# Altium project GL3227E_GL-Flash_Ver0.1.PrjPcb
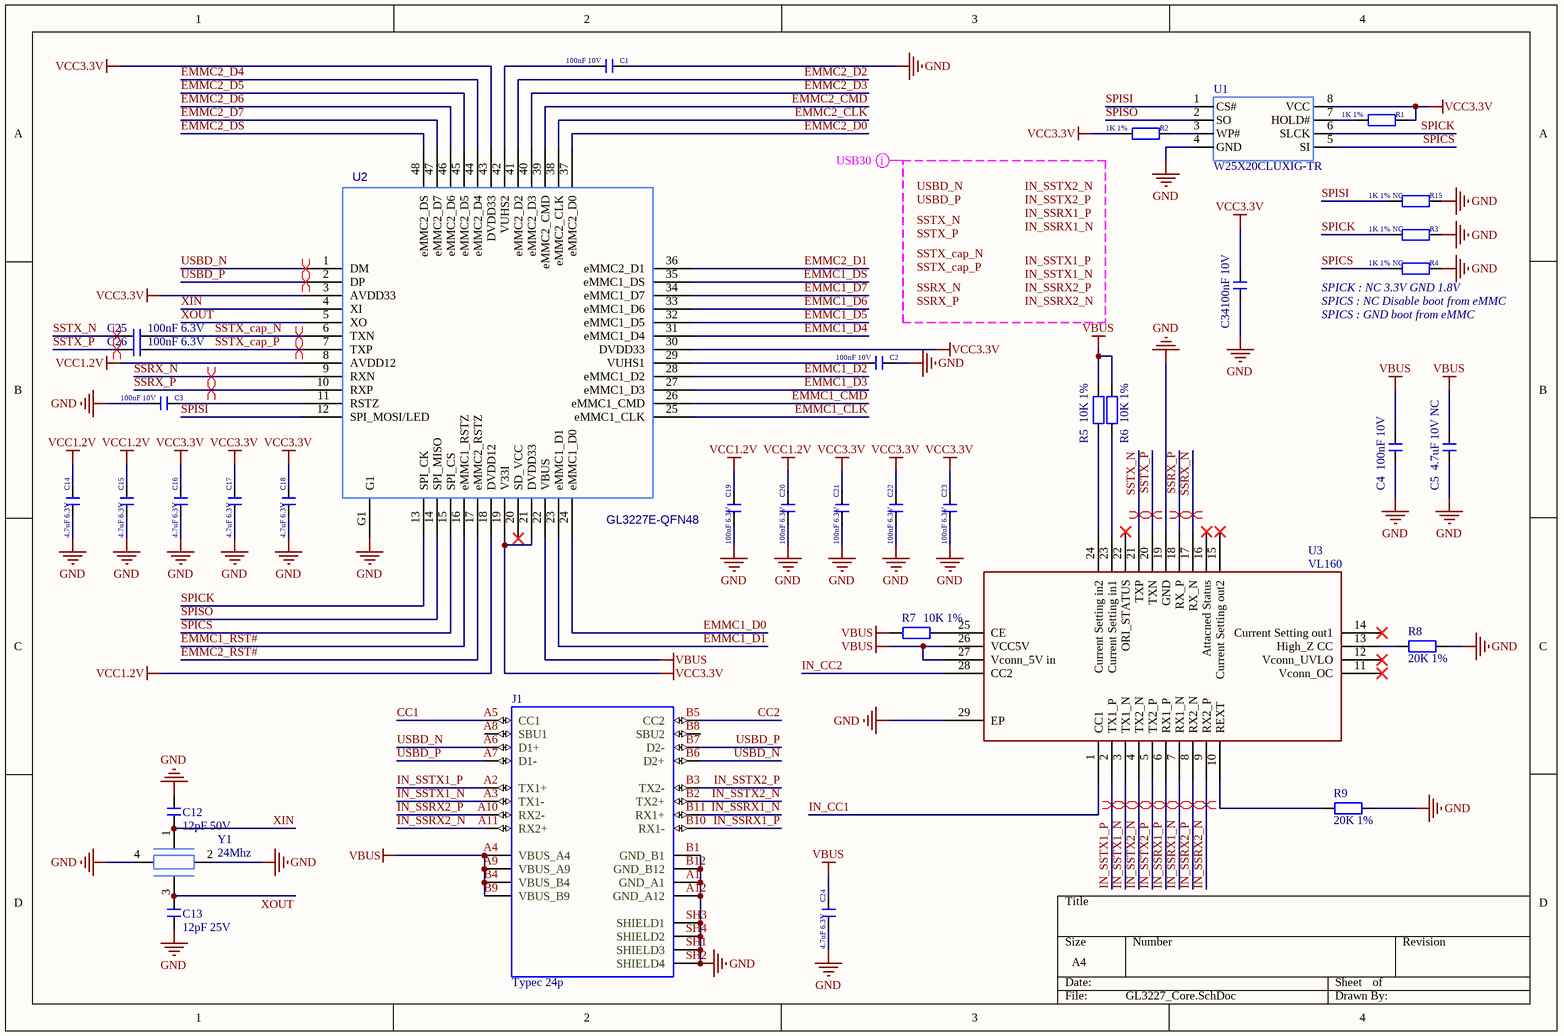
[diagram p0: GL3227_Core.SchDoc]
2 sheets, 60 parts. Net scope: global (net labels, ports and power ports of the same name join across sheets).
Board file: GL3227E_GL-Flash_Ver0.1.PcbDoc
Sheets:
  GL3227_Core.SchDoc
  emmc.SchDoc

## Sheet GL3227_Core.SchDoc
size A4; SheetNumber: 1; SheetTotal: 2

### Parts
C1  100nF 10V  [C0402_NS]
C2  100nF 10V  [C0402_NS]
C3  100nF 10V  [C0402_NS]
C4  100nF 10V  [C0402_NS]
C5  4.7uF 10V NC  [C0402_NS]
C12  12pF 50V  [C0402_NS]
C13  12pF 25V  [C0402_NS]
C14  4.7uF 6.3V  [C0402_NS]
C15  4.7uF 6.3V  [C0402_NS]
C16  4.7uF 6.3V  [C0402_NS]
C17  4.7uF 6.3V  [C0402_NS]
C18  4.7uF 6.3V  [C0402_NS]
C19  100nF 6.3V  [C0402_NS]
C20  100nF 6.3V  [C0402_NS]
C21  100nF 6.3V  [C0402_NS]
C22  100nF 6.3V  [C0402_NS]
C23  100nF 6.3V  [C0402_NS]
C24  4.7uF 6.3V  [C0402_NS]
C25  100nF 6.3V  [C0402_NS]
C26  100nF 6.3V  [C0402_NS]
C34  100nF 10V  [C0402_NS]
J1  Typec 24p  [USB-C-SMD_TYPEC-1103-BRP24]
R1  1K 1%  [R0402_NS]
R2  1K 1%  [R0402_NS]
R3  1K 1% NC  [R0402_NS]
R4  1K 1% NC  [R0402_NS]
R5  10K 1%  [R0402_NS]
R6  10K 1%  [R0402_NS]
R7  10K 1%  [R0402_NS]
R8  20K 1%  [R0402_NS]
R9  20K 1%  [R0402_NS]
R15  1K 1% NC  [R0402_NS]
U1  W25X20CLUXIG-TR  [USON-8_L1.5-W1.5-P0.40-BL-EP]
U2  value GL3227E-QFN48  [QFN48 7X7_M]  (hidden comment: GL3227E-QFN48-ON2)
U3  VL160  [MQFN-28_L4.5-W3.5-P0.40-BL-EP]
Y1  24Mhz  [OSC-1612-4P]

### Nets
GND: C1.1 C2.1 C3.2 C4.1 C5.1 C12.1 C13.1 C14.2 C15.2 C16.2 C17.2 C18.2 C19.2 C20.2 C21.2 C22.2 C23.2 C24.2 C34.1 J1.A1(GND_A1) J1.A12(GND_A12) J1.B1(GND_B1) J1.B12(GND_B12) J1.SH1(SHIELD3) J1.SH2(SHIELD4) J1.SH3(SHIELD1) J1.SH4(SHIELD2) R3.1 R4.1 R8.1 R9.1 R15.1 U1.4(GND) U2.G1 U3.19(GND) U3.29(EP) Y1.2(GND) Y1.4(GND)
VBUS: C4.2 C5.2 C24.1 J1.A4(VBUS_A4) J1.A9(VBUS_A9) J1.B4(VBUS_B4) J1.B9(VBUS_B9) R5.1 R6.1 R7.2 U2.22(VBUS) U3.26(VCC5V) U3.27(Vconn_5V_in)
VCC1.2V: C14.1 C15.1 C19.1 C20.1 U2.8(AVDD12) U2.18(DVDD12)
VCC3.3V: C16.1 C17.1 C18.1 C21.1 C22.1 C23.1 C34.2 R1.1 R2.2 U1.8(VCC) U2.3(AVDD33) U2.19(V33I) U2.21(DVDD33) U2.30(DVDD33) U2.43(DVDD33)
CC1: J1.A5(CC1)
CC2: J1.B5(CC2)
EMMC1_CLK: U2.25(eMMC1_CLK)
EMMC1_CMD: U2.26(eMMC1_CMD)
EMMC1_D0: U2.24(eMMC1_D0)
EMMC1_D1: U2.23(eMMC1_D1)
EMMC1_D2: U2.28(eMMC1_D2)
EMMC1_D3: U2.27(eMMC1_D3)
EMMC1_D4: U2.31(eMMC1_D4)
EMMC1_D5: U2.32(eMMC1_D5)
EMMC1_D6: U2.33(eMMC1_D6)
EMMC1_D7: U2.34(eMMC1_D7)
EMMC1_DS: U2.35(eMMC1_DS)
EMMC1_RST#: U2.16(eMMC1_RSTZ)
EMMC2_CLK: U2.38(eMMC2_CLK)
EMMC2_CMD: U2.39(eMMC2_CMD)
EMMC2_D0: U2.37(eMMC2_D0)
EMMC2_D1: U2.36(eMMC2_D1)
EMMC2_D2: U2.41(eMMC2_D2)
EMMC2_D3: U2.40(eMMC2_D3)
EMMC2_D4: U2.44(eMMC2_D4)
EMMC2_D5: U2.45(eMMC2_D5)
EMMC2_D6: U2.46(eMMC2_D6)
EMMC2_D7: U2.47(eMMC2_D7)
EMMC2_DS: U2.48(eMMC2_DS)
EMMC2_RST#: U2.17(eMMC2_RSTZ)
IN_CC1: U3.1(CC1)
IN_CC2: U3.28(CC2)
IN_SSRX1_N: J1.B11(RX1+) U3.7(RX1_N)
IN_SSRX1_P: J1.B10(RX1-) U3.6(RX1_P)
IN_SSRX2_N: J1.A11(RX2+) U3.9(RX2_P)
IN_SSRX2_P: J1.A10(RX2-) U3.8(RX2_N)
IN_SSTX1_N: J1.A3(TX1-) U3.3(TX1_N)
IN_SSTX1_P: J1.A2(TX1+) U3.2(TX1_P)
IN_SSTX2_N: J1.B2(TX2+) U3.4(TX2_N)
IN_SSTX2_P: J1.B3(TX2-) U3.5(TX2_P)
SPICK: R3.2 U1.6(SLCK) U2.13(SPI_CK)
SPICS: R4.2 U1.5(SI) U2.15(SPI_CS)
SPISI: R15.2 U1.1(CS#) U2.12(SPI_MOSI/LED)
SPISO: U1.2(SO) U2.14(SPI_MISO)
SSRX_N: U2.9(RXN) U3.17(RX_N)
SSRX_P: U2.10(RXP) U3.18(RX_P)
SSTX_cap_N: C25.1 U2.6(TXN)
SSTX_cap_P: C26.1 U2.7(TXP)
SSTX_N: C25.2 U3.21(TXP)
SSTX_P: C26.2 U3.20(TXN)
USBD_N: J1.A6(D1+) J1.B6(D2+) U2.1(DM)
USBD_P: J1.A7(D1-) J1.B7(D2-) U2.2(DP)
XIN: C12.2 U2.4(XI) Y1.1(XTAL_N)
XOUT: C13.2 U2.5(XO) Y1.3(XTAL_P)
NetC1_2: C1.2 U2.42(VUHS2)
NetC2_2: C2.2 U2.29(VUHS1)
NetC3_1: C3.1 U2.11(RSTZ)
NetR1_2: R1.2 U1.7(HOLD#)
NetR2_1: R2.1 U1.3(WP#)
NetR5_2: R5.2 U3.24(Current_Setting_in2)
NetR6_2: R6.2 U3.23(Current_Setting_in1)
NetR7_1: R7.1 U3.25(CE)
NetR8_2: R8.2 U3.13(High_Z_CC)
NetR9_2: R9.2 U3.10(REXT)

Not connected (* = marked no-connect by the designer): J1 A8(SBU1) B8(SBU2); U2 20(SD_VCC)*; U3 11(Vconn_OC)* 12(Vconn_UVLO)* 14(Current_Setting_out1)* 15(Current_Setting_out2)* 16(Attacned_Status)* 22(ORI_STATUS)*

### Layout directives
differential pair: IN_SSRX1_N, IN_SSRX1_P, IN_SSRX2_N, IN_SSRX2_P, IN_SSTX1_N, IN_SSTX1_P, IN_SSTX2_N, IN_SSTX2_P, SSRX_N, SSRX_P, SSTX_cap_N, SSTX_cap_P, SSTX_N, SSTX_P, USBD_N, USBD_P
net class USB30; rule Differential Pairs Routing [Pref Gap = 6mil    Min Gap  = 6mil    Max Gap  = 6milPref Width = 5.59mil    Min Width  = 5.59mil    Max Width  = 5.59mil]: IN_SSRX1_N, IN_SSRX1_P, IN_SSRX2_N, IN_SSRX2_P, IN_SSTX1_N, IN_SSTX1_P, IN_SSTX2_N, IN_SSTX2_P, SSRX_N, SSRX_P, SSTX_cap_N, SSTX_cap_P, SSTX_N, SSTX_P, USBD_N, USBD_P

### Notes on the sheet
- (near R4) SPICK : NC 3.3V GND 1.8V
- (near R4) SPICS : NC Disable boot from eMMC
- (near R4) SPICS : GND boot from eMMC
- Labels drawn without touching a wire or pin: IN_SSRX1_N, IN_SSRX1_P, IN_SSRX2_N, IN_SSRX2_P, IN_SSTX1_N, IN_SSTX1_P, IN_SSTX2_N, IN_SSTX2_P, SSRX_N, SSRX_P, SSTX_cap_N, SSTX_cap_P, SSTX_N, SSTX_P, USBD_N, USBD_P

### Library data of the parts
C1-C5 C12-C26 C34 = C: 无极性贴片电容; 版权归属: 源创客; 材质: X7R; BOM名称: 无极性贴片电容; 学习资源: www.ooocke.com
J1 = Typec 24p: USB-C (USB TYPE-C) USB 3.2 Gen 2 (USB 3.1 Gen 2, Superspeed + (USB 3.1)) Receptacle Connector 24 Position Surface Mount, Right Angle; Through Hole; MF: Molex; MP: 1054500101; SnapEDA_Link: https://www.snapeda.com/parts/1054500101/Molex/view-part/?ref=snap; Package: None; Value: *; Check_prices: https://www.snapeda.com/parts/1054500101/Molex/view-part/?ref=eda
R1-R9 R15 = R: 贴片电阻; 版权归属: 源创客; BOM名称: 贴片电阻; 学习资源: www.ooocke.com
U1 = P25D40H
U2 = GL3227E-QFN48-ON2: pin to pad: G1>49; Part Reference: U1; PCB Footprint: sks-qfn48-6x6x0_4a
Y1 = Crystal

## Sheet emmc.SchDoc
size 350 x 219 mm; SheetNumber: 2; SheetTotal: 2
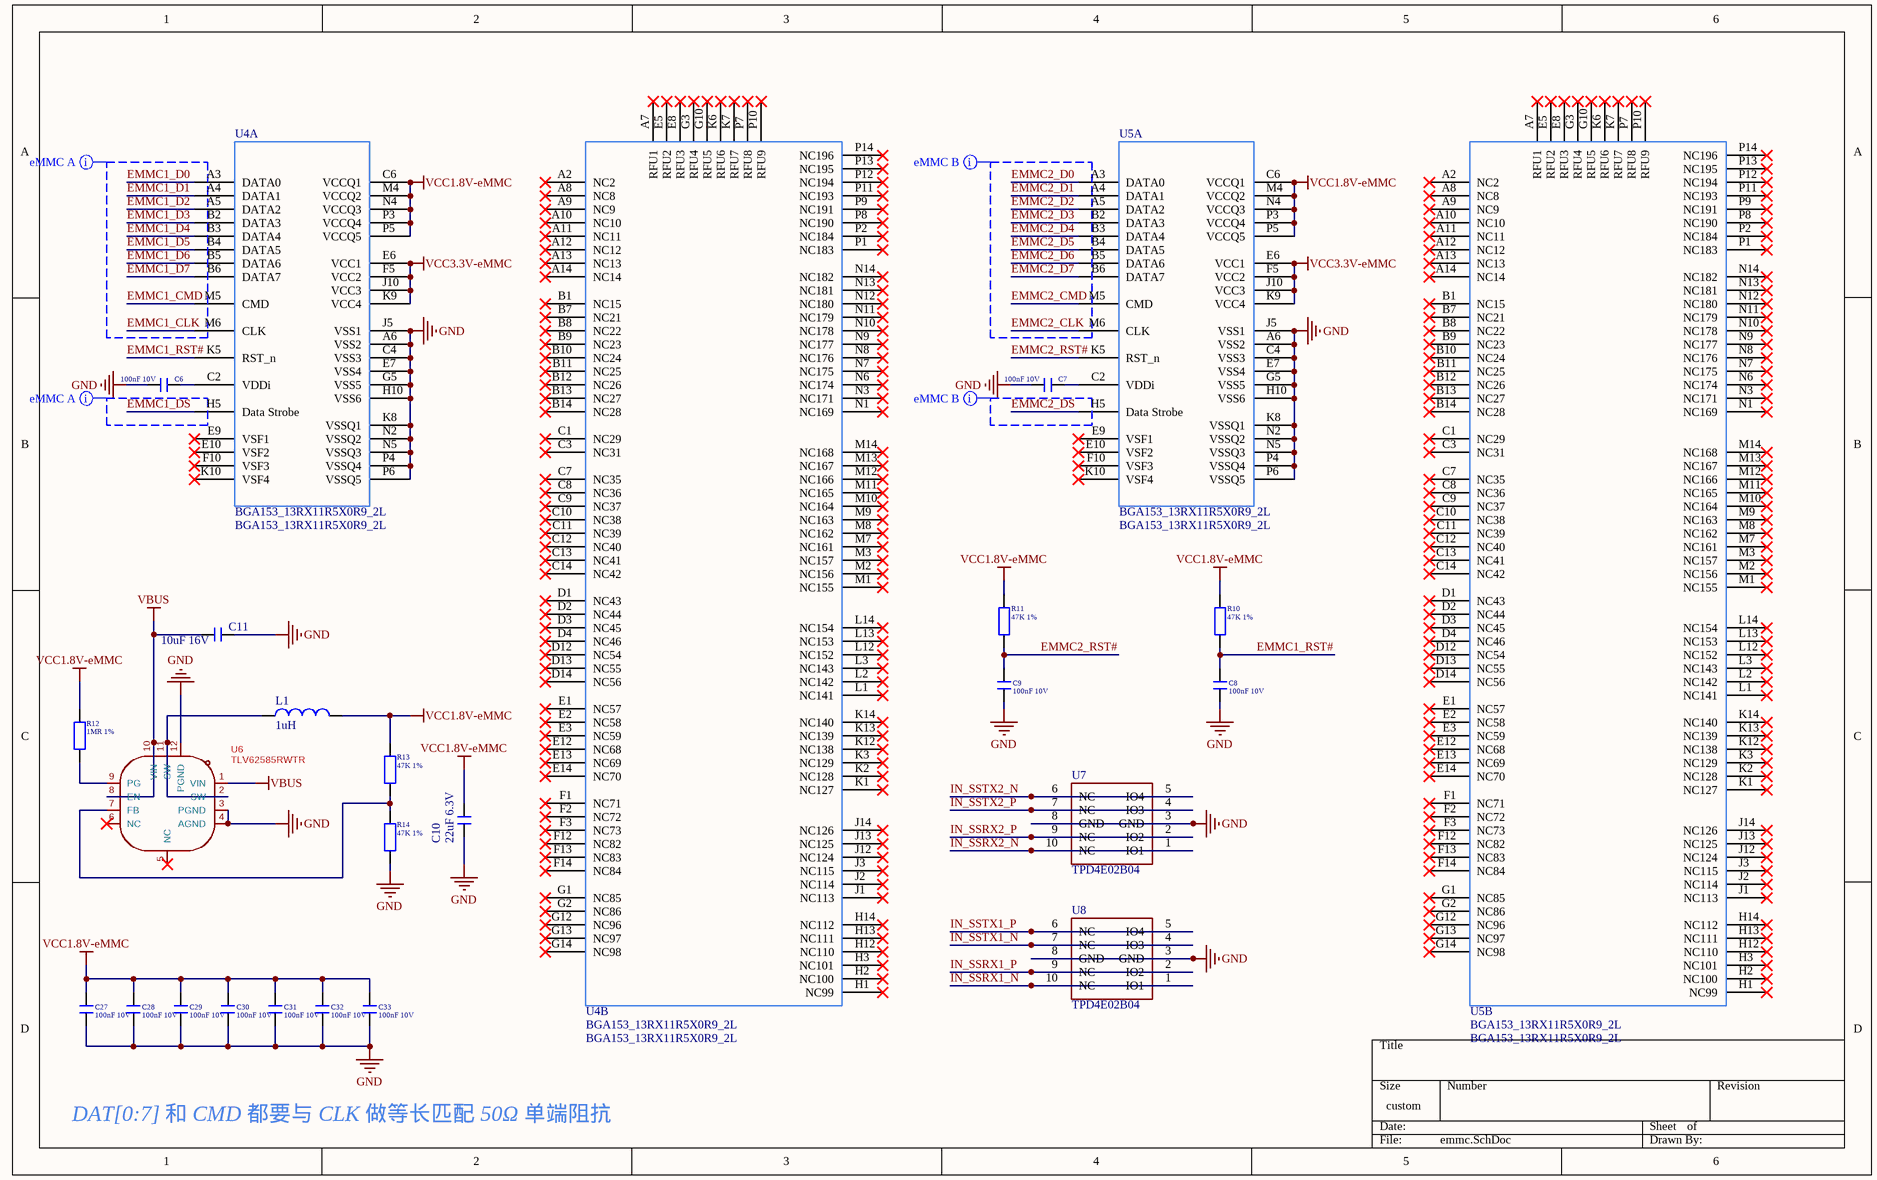
[diagram p1: emmc.SchDoc]

### Parts
C6  100nF 10V  [C0402_NS]
C7  100nF 10V  [C0402_NS]
C8  100nF 10V  [C0402_NS]
C9  100nF 10V  [C0402_NS]
C10  22uF 6.3V  [C0402_NS]
C11  10uF 16V  [C0402_NS]
C27  100nF 10V  [C0603_NS]
C28  100nF 10V  [C0603_NS]
C29  100nF 10V  [C0603_NS]
C30  100nF 10V  [C0603_NS]
C31  100nF 10V  [C0603_NS]
C32  100nF 10V  [C0603_NS]
C33  100nF 10V  [C0603_NS]
L1  1uH  [L 0805_L]
R10  47K 1%  [R0402_NS]
R11  47K 1%  [R0402_NS]
R12  1MR 1%  [R0402_NS]
R13  47K 1%  [R0402_NS]
R14  47K 1%  [R0402_NS]
U4  BGA153_13RX11R5X0R9_2L  [FBGA-153_L13.0-W11.5-P0.50_KLMAG1JETD-B041]  (parts A,B of 2)
U5  BGA153_13RX11R5X0R9_2L  [FBGA-153_L13.0-W11.5-P0.50_KLMAG1JETD-B041]  (parts A,B of 2)
U6  TLV62585RWTR  [VQFN-HR-12_L2.0-W2.0-P0.50-BL]
U7  TPD4E02B04  [DIO_TPD4E02B04DQAR]
U8  TPD4E02B04  [DIO_TPD4E02B04DQAR]

### Nets
GND: C6.2 C7.2 C8.2 C9.2 C10.1 C11.1 C27.2 C28.2 C29.2 C30.2 C31.2 C32.2 C33.2 R14.2 U4.A6(VSS2) U4.C4(VSS3) U4.E7(VSS4) U4.G5(VSS5) U4.H10(VSS6) U4.J5(VSS1) U4.K8(VSSQ1) U4.N2(VSSQ2) U4.N5(VSSQ3) U4.P4(VSSQ4) U4.P6(VSSQ5) U5.A6(VSS2) U5.C4(VSS3) U5.E7(VSS4) U5.G5(VSS5) U5.H10(VSS6) U5.J5(VSS1) U5.K8(VSSQ1) U5.N2(VSSQ2) U5.N5(VSSQ3) U5.P4(VSSQ4) U5.P6(VSSQ5) U6.3(PGND) U6.4(AGND) U6.12(PGND) U7.3(GND) U7.8(GND) U8.3(GND) U8.8(GND)
VBUS: C11.2 U6.1(VIN) U6.8(EN) U6.10(VIN)
VCC1.8V-eMMC: C10.2 C27.1 C28.1 C29.1 C30.1 C31.1 C32.1 C33.1 L1.2 R10.1 R11.1 R12.1 R13.1 U4.C6(VCCQ1) U4.M4(VCCQ2) U4.N4(VCCQ3) U4.P3(VCCQ4) U4.P5(VCCQ5) U5.C6(VCCQ1) U5.M4(VCCQ2) U5.N4(VCCQ3) U5.P3(VCCQ4) U5.P5(VCCQ5)
VCC3.3V-eMMC: U4.E6(VCC1) U4.F5(VCC2) U4.J10(VCC3) U4.K9(VCC4) U5.E6(VCC1) U5.F5(VCC2) U5.J10(VCC3) U5.K9(VCC4)
EMMC1_CLK: U4.M6(CLK)
EMMC1_CMD: U4.M5(CMD)
EMMC1_D0: U4.A3(DATA0)
EMMC1_D1: U4.A4(DATA1)
EMMC1_D2: U4.A5(DATA2)
EMMC1_D3: U4.B2(DATA3)
EMMC1_D4: U4.B3(DATA4)
EMMC1_D5: U4.B4(DATA5)
EMMC1_D6: U4.B5(DATA6)
EMMC1_D7: U4.B6(DATA7)
EMMC1_DS: U4.H5(Data_Strobe)
EMMC1_RST#: C8.1 R10.2 U4.K5(RST_n)
EMMC2_CLK: U5.M6(CLK)
EMMC2_CMD: U5.M5(CMD)
EMMC2_D0: U5.A3(DATA0)
EMMC2_D1: U5.A4(DATA1)
EMMC2_D2: U5.A5(DATA2)
EMMC2_D3: U5.B2(DATA3)
EMMC2_D4: U5.B3(DATA4)
EMMC2_D5: U5.B4(DATA5)
EMMC2_D6: U5.B5(DATA6)
EMMC2_D7: U5.B6(DATA7)
EMMC2_DS: U5.H5(Data_Strobe)
EMMC2_RST#: C9.1 R11.2 U5.K5(RST_n)
IN_SSRX1_N: U8.1(IO1) U8.10(NC)
IN_SSRX1_P: U8.2(IO2) U8.9(NC)
IN_SSRX2_N: U7.1(IO1) U7.10(NC)
IN_SSRX2_P: U7.2(IO2) U7.9(NC)
IN_SSTX1_N: U8.4(IO3) U8.7(NC)
IN_SSTX1_P: U8.5(IO4) U8.6(NC)
IN_SSTX2_N: U7.5(IO4) U7.6(NC)
IN_SSTX2_P: U7.4(IO3) U7.7(NC)
NetC6_1: C6.1 U4.C2(VDDi)
NetC7_1: C7.1 U5.C2(VDDi)
NetL1_1: L1.1 U6.2(SW) U6.11(SW)
NetR12_2: R12.2 U6.9(PG)
NetR13_2: R13.2 R14.1 U6.7(FB)

Not connected (* = marked no-connect by the designer): U4 A2(NC2)* A7(RFU1)* A8(NC8)* A9(NC9)* A10(NC10)* A11(NC11)* A12(NC12)* A13(NC13)* A14(NC14)* B1(NC15)* B7(NC21)* B8(NC22)* B9(NC23)* B10(NC24)* B11(NC25)* B12(NC26)* B13(NC27)* B14(NC28)* C1(NC29)* C3(NC31)* C7(NC35)* C8(NC36)* C9(NC37)* C10(NC38)* C11(NC39)* C12(NC40)* C13(NC41)* C14(NC42)* D1(NC43)* D2(NC44)* D3(NC45)* D4(NC46)* D12(NC54)* D13(NC55)* D14(NC56)* E1(NC57)* E2(NC58)* E3(NC59)* E5(RFU2)* E8(RFU3)* E9(VSF1)* E10(VSF2)* E12(NC68)* E13(NC69)* E14(NC70)* F1(NC71)* F2(NC72)* F3(NC73)* F10(VSF3)* F12(NC82)* F13(NC83)* F14(NC84)* G1(NC85)* G2(NC86)* G3(RFU4)* G10(RFU5)* G12(NC96)* G13(NC97)* G14(NC98)* H1(NC99)* H2(NC100)* H3(NC101)* H12(NC110)* H13(NC111)* H14(NC112)* J1(NC113)* J2(NC114)* J3(NC115)* J12(NC124)* J13(NC125)* J14(NC126)* K1(NC127)* K2(NC128)* K3(NC129)* K6(RFU6)* K7(RFU7)* K10(VSF4)* K12(NC138)* K13(NC139)* K14(NC140)* L1(NC141)* L2(NC142)* L3(NC143)* L12(NC152)* L13(NC153)* L14(NC154)* M1(NC155)* M2(NC156)* M3(NC157)* M7(NC161)* M8(NC162)* M9(NC163)* M10(NC164)* M11(NC165)* M12(NC166)* M13(NC167)* M14(NC168)* N1(NC169)* N3(NC171)* N6(NC174)* N7(NC175)* N8(NC176)* N9(NC177)* N10(NC178)* N11(NC179)* N12(NC180)* N13(NC181)* N14(NC182)* P1(NC183)* P2(NC184)* P7(RFU8)* P8(NC190)* P9(NC191)* P10(RFU9)* P11(NC193)* P12(NC194)* P13(NC195)* P14(NC196)*; U5 A2(NC2)* A7(RFU1)* A8(NC8)* A9(NC9)* A10(NC10)* A11(NC11)* A12(NC12)* A13(NC13)* A14(NC14)* B1(NC15)* B7(NC21)* B8(NC22)* B9(NC23)* B10(NC24)* B11(NC25)* B12(NC26)* B13(NC27)* B14(NC28)* C1(NC29)* C3(NC31)* C7(NC35)* C8(NC36)* C9(NC37)* C10(NC38)* C11(NC39)* C12(NC40)* C13(NC41)* C14(NC42)* D1(NC43)* D2(NC44)* D3(NC45)* D4(NC46)* D12(NC54)* D13(NC55)* D14(NC56)* E1(NC57)* E2(NC58)* E3(NC59)* E5(RFU2)* E8(RFU3)* E9(VSF1)* E10(VSF2)* E12(NC68)* E13(NC69)* E14(NC70)* F1(NC71)* F2(NC72)* F3(NC73)* F10(VSF3)* F12(NC82)* F13(NC83)* F14(NC84)* G1(NC85)* G2(NC86)* G3(RFU4)* G10(RFU5)* G12(NC96)* G13(NC97)* G14(NC98)* H1(NC99)* H2(NC100)* H3(NC101)* H12(NC110)* H13(NC111)* H14(NC112)* J1(NC113)* J2(NC114)* J3(NC115)* J12(NC124)* J13(NC125)* J14(NC126)* K1(NC127)* K2(NC128)* K3(NC129)* K6(RFU6)* K7(RFU7)* K10(VSF4)* K12(NC138)* K13(NC139)* K14(NC140)* L1(NC141)* L2(NC142)* L3(NC143)* L12(NC152)* L13(NC153)* L14(NC154)* M1(NC155)* M2(NC156)* M3(NC157)* M7(NC161)* M8(NC162)* M9(NC163)* M10(NC164)* M11(NC165)* M12(NC166)* M13(NC167)* M14(NC168)* N1(NC169)* N3(NC171)* N6(NC174)* N7(NC175)* N8(NC176)* N9(NC177)* N10(NC178)* N11(NC179)* N12(NC180)* N13(NC181)* N14(NC182)* P1(NC183)* P2(NC184)* P7(RFU8)* P8(NC190)* P9(NC191)* P10(RFU9)* P11(NC193)* P12(NC194)* P13(NC195)* P14(NC196)*; U6 5(NC)* 6(NC)*

### Layout directives
net class eMMC A; rule Width Constraint [Pref Width = 6.16mil    Min Width = 6.16mil    Max Width = 6.16mil]: EMMC1_CLK, EMMC1_CMD, EMMC1_D0, EMMC1_D1, EMMC1_D2, EMMC1_D3, EMMC1_D4, EMMC1_D5, EMMC1_D6, EMMC1_D7, EMMC1_DS
net class eMMC B; rule Width Constraint [Pref Width = 6.16mil    Min Width = 6.16mil    Max Width = 6.16mil]: EMMC2_CLK, EMMC2_CMD, EMMC2_D0, EMMC2_D1, EMMC2_D2, EMMC2_D3, EMMC2_D4, EMMC2_D5, EMMC2_D6, EMMC2_D7, EMMC2_DS

### Notes on the sheet
- DAT[0:7] 和 CMD 都要与 CLK 做等长匹配 50Ω 单端阻抗

### Library data of the parts
C6-C11 C27-C33 = C: 无极性贴片电容; 版权归属: 源创客; 材质: X7R; BOM名称: 无极性贴片电容; 学习资源: www.ooocke.com
L1 = L: 小功率贴片电感; 版权归属: 源创客; BOM名称: 小功率贴片电感; 学习资源: www.ooocke.com
R10-R14 = R: 贴片电阻; 版权归属: 源创客; BOM名称: 贴片电阻; 学习资源: www.ooocke.com
U4 U5 = INAND_EMMC_153_2L: EMMC_B153_2L,更好的满足工艺需求，Fanout方式部分走线跨接再球位上，挖除A1\C5球位; Priority: A; RK PN: EMMC_B153_2L; Part Type: NAND_FLASH; Created by: YWQ; PCB Footprint: BGA153_13RX11R5X0R9_2L
U6 = TLV62585RWTR: 功能类型:降压型;输出类型:可调;工作电压:2.5V~5.5V;输出电压:600mV~5.5V;输出电流:3A;; Manufacturer: TI(德州仪器); AddInBom: yes; ModelId: 2955a7eb91f6440293a731726d4b8758聨0819f05c4eef4c71ace90d822a990e87; ModelName: VQFN-HR-12_L2.0-W2.0-H0.9-P0.50-BL; ModelTransform: 78.74,78.74,0,90,0,0,-0.005,0.005,0; Function: 降压型; Output Type: 可调; Output Current: 3A; Switching Frequency: 1.5MHz; Synchronous Rectification: 是; Number of Outputs: 1; Topology: 降压式; Quiescent Current (Iq): 35uA; Switch tube (built-in/external): 内置; Symbol: TLV62585RWTR; Device: TLV62585RWTR; LCSC Part Name: 高效率同步降压转换器; SupplierPart: C406872; ManufacturerPart: TLV62585RWTR; Supplier Footprint: VQFN-11-HR(2x3); JLCPCB Part Class: Extended Part; Datasheet: https://www.ti.com/cn/lit/gpn/tlv62585; Supplier: LCSC; ConvertToPcb: yes; FootprintName: VQFN-HR-12_L2.0-W2.0-P0.50-BL; Input Voltage: 2.5V~5.5V; Output Voltage: 600mV~5.5V; Operating Temperature: -40℃~+125℃
U7 U8 = TPD4E02B04: ESD

## Nets that join several sheets
GND: GL3227_Core (38 pins), emmc (43 pins)
VBUS: GL3227_Core (13 pins), emmc (C11.2 U6.1 U6.8 U6.10)
EMMC1_CLK: GL3227_Core (U2.25), emmc (U4.M6)
EMMC1_CMD: GL3227_Core (U2.26), emmc (U4.M5)
EMMC1_D0: GL3227_Core (U2.24), emmc (U4.A3)
EMMC1_D1: GL3227_Core (U2.23), emmc (U4.A4)
EMMC1_D2: GL3227_Core (U2.28), emmc (U4.A5)
EMMC1_D3: GL3227_Core (U2.27), emmc (U4.B2)
EMMC1_D4: GL3227_Core (U2.31), emmc (U4.B3)
EMMC1_D5: GL3227_Core (U2.32), emmc (U4.B4)
EMMC1_D6: GL3227_Core (U2.33), emmc (U4.B5)
EMMC1_D7: GL3227_Core (U2.34), emmc (U4.B6)
EMMC1_DS: GL3227_Core (U2.35), emmc (U4.H5)
EMMC1_RST#: GL3227_Core (U2.16), emmc (C8.1 R10.2 U4.K5)
EMMC2_CLK: GL3227_Core (U2.38), emmc (U5.M6)
EMMC2_CMD: GL3227_Core (U2.39), emmc (U5.M5)
EMMC2_D0: GL3227_Core (U2.37), emmc (U5.A3)
EMMC2_D1: GL3227_Core (U2.36), emmc (U5.A4)
EMMC2_D2: GL3227_Core (U2.41), emmc (U5.A5)
EMMC2_D3: GL3227_Core (U2.40), emmc (U5.B2)
EMMC2_D4: GL3227_Core (U2.44), emmc (U5.B3)
EMMC2_D5: GL3227_Core (U2.45), emmc (U5.B4)
EMMC2_D6: GL3227_Core (U2.46), emmc (U5.B5)
EMMC2_D7: GL3227_Core (U2.47), emmc (U5.B6)
EMMC2_DS: GL3227_Core (U2.48), emmc (U5.H5)
EMMC2_RST#: GL3227_Core (U2.17), emmc (C9.1 R11.2 U5.K5)
IN_SSRX1_N: GL3227_Core (J1.B11 U3.7), emmc (U8.1 U8.10)
IN_SSRX1_P: GL3227_Core (J1.B10 U3.6), emmc (U8.2 U8.9)
IN_SSRX2_N: GL3227_Core (J1.A11 U3.9), emmc (U7.1 U7.10)
IN_SSRX2_P: GL3227_Core (J1.A10 U3.8), emmc (U7.2 U7.9)
IN_SSTX1_N: GL3227_Core (J1.A3 U3.3), emmc (U8.4 U8.7)
IN_SSTX1_P: GL3227_Core (J1.A2 U3.2), emmc (U8.5 U8.6)
IN_SSTX2_N: GL3227_Core (J1.B2 U3.4), emmc (U7.5 U7.6)
IN_SSTX2_P: GL3227_Core (J1.B3 U3.5), emmc (U7.4 U7.7)